# Altium schematic sheet MemoryLatch.SchDoc
size A; SheetNumber: 18; SheetTotal: 18
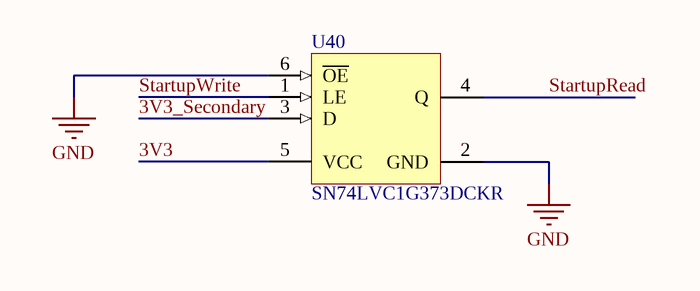
[diagram p0: MemoryLatch.SchDoc]

## Parts
U40  SN74LVC1G373DCKR  [DCK0006A_M]

## Nets
GND: U40.2(GND) U40.6(~{OE})
3V3: U40.5(VCC)
3V3_Secondary: U40.3(D)
StartupRead: U40.4(Q)
StartupWrite: U40.1(LE)

## Library data of the parts
U40 = CMP-019-00050-1: Bus Driver, LVC/LCX/Z Series, 1-Func, 1-Bit, True Output, CMOS, PDSO6; Min Supply Voltage: 1.65V; Max Supply Voltage: 5.5V; RoHS Compliant: Yes; Min Operating Temperature: -40°C; Case/Package: TSSOP; Max Operating Temperature: 125°C; Pins: 6